# EAGLE design PCB-AC4 (EAGLE 7.7.0)

## Sheet 1 of 2
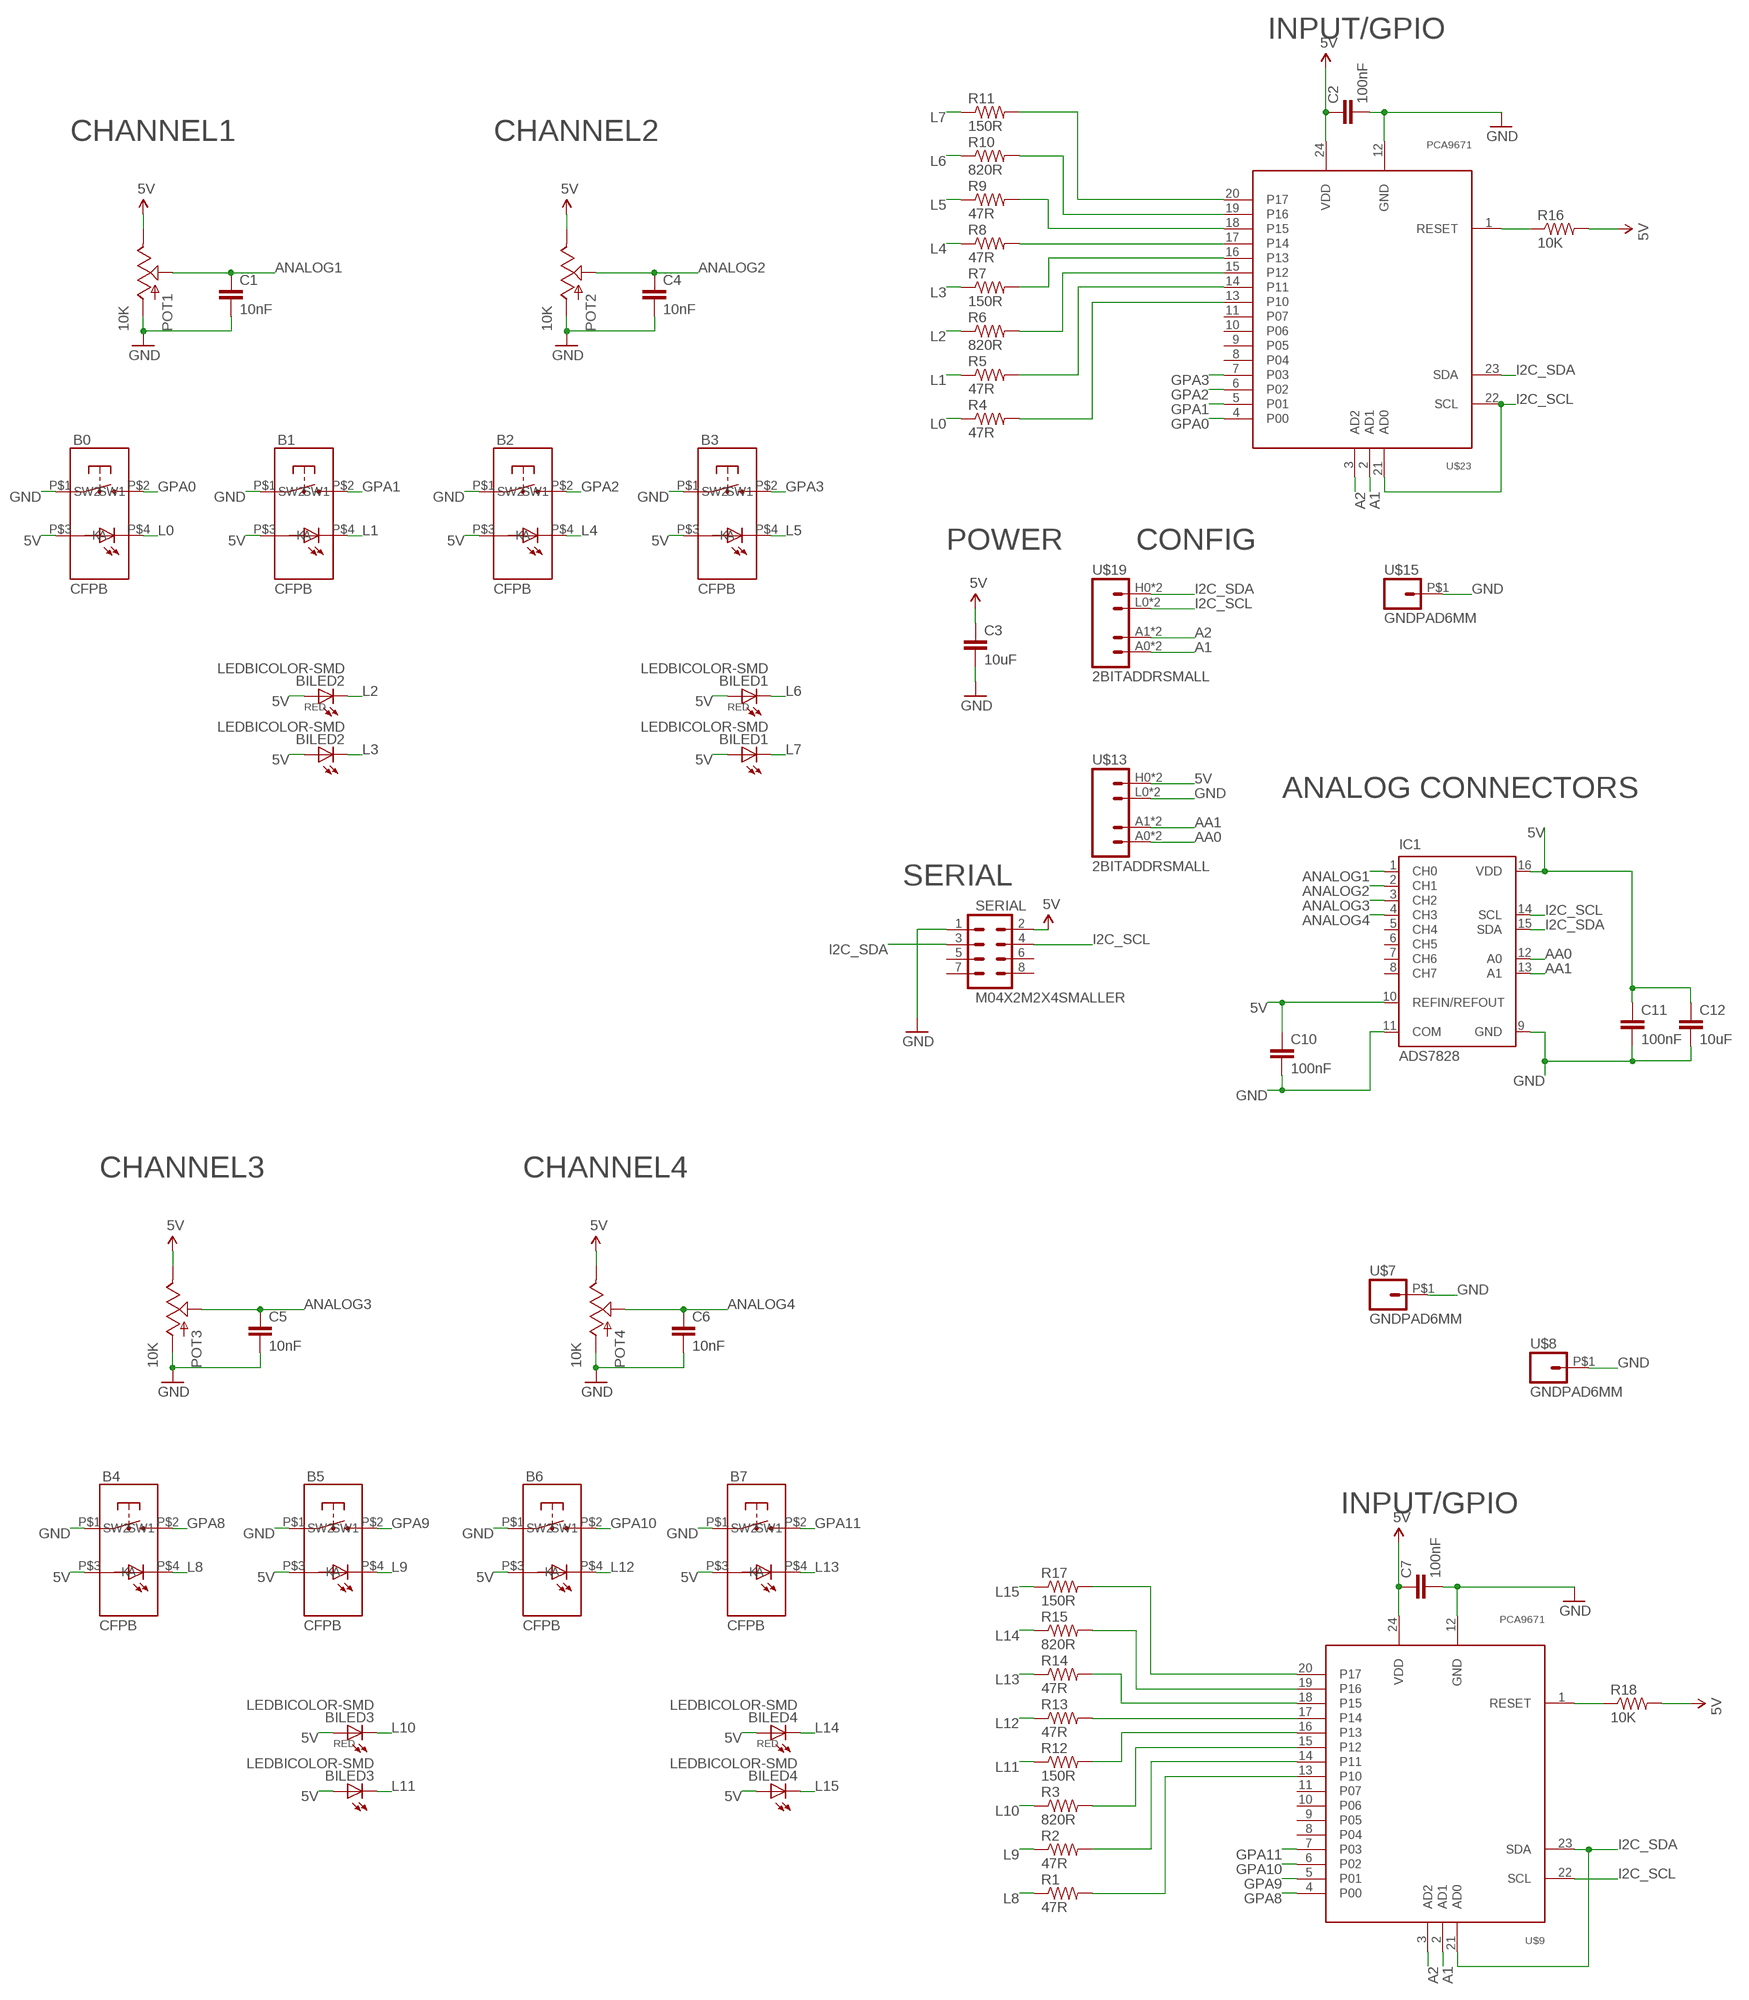
[diagram p0: schematic, sheet 1]

### Parts
B0  CFPB  [CFPB-6/9MM]
B1  CFPB  [CFPB-6/9MM]
B2  CFPB  [CFPB-6/9MM]
B3  CFPB  [CFPB-6/9MM]
B4  CFPB  [CFPB-6/9MM]
B5  CFPB  [CFPB-6/9MM]
B6  CFPB  [CFPB-6/9MM]
B7  CFPB  [CFPB-6/9MM]
BILED1  LEDBICOLOR-SMD  [LEDBICOLOR-SMD]
BILED2  LEDBICOLOR-SMD  [LEDBICOLOR-SMD]
BILED3  LEDBICOLOR-SMD  [LEDBICOLOR-SMD]
BILED4  LEDBICOLOR-SMD  [LEDBICOLOR-SMD]
C1  10nF  CAP0603-CAP  [0603-CAP]
C2  100nF  CAP0603-CAP  [0603-CAP]
C3  10uF  CAP0805  [0805]
C4  10nF  CAP0603-CAP  [0603-CAP]
C5  10nF  CAP0603-CAP  [0603-CAP]
C6  10nF  CAP0603-CAP  [0603-CAP]
C7  100nF  CAP0603-CAP  [0603-CAP]
C10  100nF  CAP0603-CAP  [0603-CAP]
C11  100nF  CAP0603-CAP  [0603-CAP]
C12  10uF  CAP0805  [0805]
IC1  ADS7828  [TSSOP16-PW]
POT1  10K  POT  [ALPS_POT]
POT2  10K  POT  [ALPS_POT]
POT3  10K  POT  [ALPS_POT]
POT4  10K  POT  [ALPS_POT]
R1  47R  RESISTOR0603-RES  [0603-RES]
R2  47R  RESISTOR0603-RES  [0603-RES]
R3  820R  RESISTOR0603-RES  [0603-RES]
R4  47R  RESISTOR0603-RES  [0603-RES]
R5  47R  RESISTOR0603-RES  [0603-RES]
R6  820R  RESISTOR0603-RES  [0603-RES]
R7  150R  RESISTOR0603-RES  [0603-RES]
R8  47R  RESISTOR0603-RES  [0603-RES]
R9  47R  RESISTOR0603-RES  [0603-RES]
R10  820R  RESISTOR0603-RES  [0603-RES]
R11  150R  RESISTOR0603-RES  [0603-RES]
R12  150R  RESISTOR0603-RES  [0603-RES]
R13  47R  RESISTOR0603-RES  [0603-RES]
R14  47R  RESISTOR0603-RES  [0603-RES]
R15  820R  RESISTOR0603-RES  [0603-RES]
R16  10K  RESISTOR0603-RES  [0603-RES]
R17  150R  RESISTOR0603-RES  [0603-RES]
R18  10K  RESISTOR0603-RES  [0603-RES]
SERIAL  M04X2M2X4SMALLER  [M2X4SMALLER]
U$7  GNDPAD6MM  [3.2MMPAD6MM]
U$8  GNDPAD6MM  [3.2MMPAD6MM]
U$9  PCA9671  [TSSOP24]
U$13  2BITADDRSMALL  [2BITADDR_SMALL]
U$15  GNDPAD6MM  [3.2MMPAD6MM]
U$19  2BITADDRSMALL  [2BITADDR_SMALL]
U$23  PCA9671  [TSSOP24]

### Nets
5V [Power]: B0.P$3(A) B1.P$3(A) B2.P$3(A) B3.P$3(A) B4.P$3(A) B5.P$3(A) B6.P$3(A) B7.P$3(A) BILED1.P$1(A) BILED1.P$3(A1) BILED2.P$1(A) BILED2.P$3(A1) BILED3.P$1(A) BILED3.P$3(A1) BILED4.P$1(A) BILED4.P$3(A1) C2.1 C3.1 C7.1 C10.1 C11.1 C12.1 IC1.10(REFIN/REFOUT) IC1.16(VDD) POT1.P$1(E) POT2.P$1(E) POT3.P$1(E) POT4.P$1(E) R16.2 R18.2 SERIAL.2 U$9.24(VDD) U$13.H0(VCC) U$13.H1(VCC) U$23.24(VDD)
A1: U$9.2(AD1) U$19.A0(A1) U$19.AS0(A1) U$23.2(AD1)
A2: U$9.3(AD2) U$19.A1(A2) U$19.AS1(A2) U$23.3(AD2)
AA0: IC1.12(A0) U$13.A0(A1) U$13.AS0(A1)
AA1: IC1.13(A1) U$13.A1(A2) U$13.AS1(A2)
ANALOG1: C1.1 IC1.1(CH0) POT1.P$2(S)
ANALOG2: C4.1 IC1.2(CH1) POT2.P$2(S)
ANALOG3: C5.1 IC1.3(CH2) POT3.P$2(S)
ANALOG4: C6.1 IC1.4(CH3) POT4.P$2(S)
GND [Power]: B0.P$1(SW1) B1.P$1(SW1) B2.P$1(SW1) B3.P$1(SW1) B4.P$1(SW1) B5.P$1(SW1) B6.P$1(SW1) B7.P$1(SW1) C1.2 C2.2 C3.2 C4.2 C5.2 C6.2 C7.2 C10.2 C11.2 C12.2 IC1.9(GND) IC1.11(COM) POT1.P$3(A) POT2.P$3(A) POT3.P$3(A) POT4.P$3(A) SERIAL.1 U$7.P$1 U$8.P$1 U$9.12(GND) U$13.L0(GND) U$13.L1(GND) U$15.P$1 U$23.12(GND)
GPA0: B0.P$2(SW2) U$23.4(P00)
GPA1: B1.P$2(SW2) U$23.5(P01)
GPA2: B2.P$2(SW2) U$23.6(P02)
GPA3: B3.P$2(SW2) U$23.7(P03)
GPA8: B4.P$2(SW2) U$9.4(P00)
GPA9: B5.P$2(SW2) U$9.5(P01)
GPA10: B6.P$2(SW2) U$9.6(P02)
GPA11: B7.P$2(SW2) U$9.7(P03)
I2C_SCL: IC1.14(SCL) SERIAL.4 U$9.22(SCL) U$19.L0(GND) U$19.L1(GND) U$23.21(AD0) U$23.22(SCL)
I2C_SDA: IC1.15(SDA) SERIAL.3 U$9.21(AD0) U$9.23(SDA) U$19.H0(VCC) U$19.H1(VCC) U$23.23(SDA)
L0: B0.P$4(K) R4.1
L1: B1.P$4(K) R5.1
L2: BILED2.P$2(C) R6.1
L3: BILED2.P$4(C1) R7.1
L4: B2.P$4(K) R8.1
L5: B3.P$4(K) R9.1
L6: BILED1.P$2(C) R10.1
L7: BILED1.P$4(C1) R11.1
L8: B4.P$4(K) R1.1
L9: B5.P$4(K) R2.1
L10: BILED3.P$2(C) R3.1
L11: BILED3.P$4(C1) R12.1
L12: B6.P$4(K) R13.1
L13: B7.P$4(K) R14.1
L14: BILED4.P$2(C) R15.1
L15: BILED4.P$4(C1) R17.1
N$1: R12.2 U$9.16(P13)
N$2: R7.2 U$23.16(P13)
N$3: R8.2 U$23.17(P14)
N$4: R9.2 U$23.18(P15)
N$5: R10.2 U$23.19(P16)
N$6: R11.2 U$23.20(P17)
N$7: R6.2 U$23.15(P12)
N$8: R5.2 U$23.14(P11)
N$9: R4.2 U$23.13(P10)
N$10: R13.2 U$9.17(P14)
N$11: R14.2 U$9.18(P15)
N$12: R15.2 U$9.19(P16)
N$13: R17.2 U$9.20(P17)
N$14: R3.2 U$9.15(P12)
N$15: R2.2 U$9.14(P11)
N$16: R1.2 U$9.13(P10)
N$17: R18.1 U$9.1(RESET)
N$22: R16.1 U$23.1(RESET)
Unconnected: IC1.5(CH4) IC1.6(CH5) IC1.7(CH6) IC1.8(CH7) SERIAL.5 SERIAL.6 SERIAL.7 SERIAL.8 U$9.8(P04) U$9.9(P05) U$9.10(P06) U$9.11(P07) U$23.8(P04) U$23.9(P05) U$23.10(P06) U$23.11(P07)

### Notes on the sheet
- INPUT/GPIO
- CHANNEL1 | CHANNEL2
- POWER | CONFIG
- ANALOG CONNECTORS
- SERIAL
- CHANNEL3 | CHANNEL4
- INPUT/GPIO

## Sheet 2 of 2

## Library data of the parts
B0 B1-B7 = SKAARHOJ:CFPB
BILED1-BILED4 = SKAARHOJ:LEDBICOLOR-SMD
C1-C7 C10-C12 = SparkFun:CAP: Capacitor Standard 0603 ceramic capacitor, and 0.1" leaded capacitor.
IC1 = burr-brown:ADS7828: 12-Bit, 8-Channel Sampling ANALOG-TO-DIGITAL CONVERTER with I2C? Interface Source: www.ti.com .. ADS7828.pdf; MF: TEXAS INSTRUMENTS; MPN: ADS7828E/250; OC_FARNELL: 1470338; OC_NEWARK: 74C7158
POT1-POT4 = SparkFun:POT
R1-R18 = SparkFun:RESISTOR: Resistor Basic schematic elements and footprints for 0603, 1206, and PTH resistors.
SERIAL = SKAARHOJ:M04X2
U$7 U$8 U$15 = SKAARHOJ:GNDPAD
U$9 U$23 = SKAARHOJ:PCA9671
U$13 U$19 = SKAARHOJ:2BITADDR

## Net classes
0 default: width 0.203 mm, drill 0.406 mm, clearance 0.203 mm
1 Power: width 0.406 mm, drill 0.61 mm, clearance 0.203 mm
2 Signal: width 0.152 mm, clearance 0.152 mm

## Board
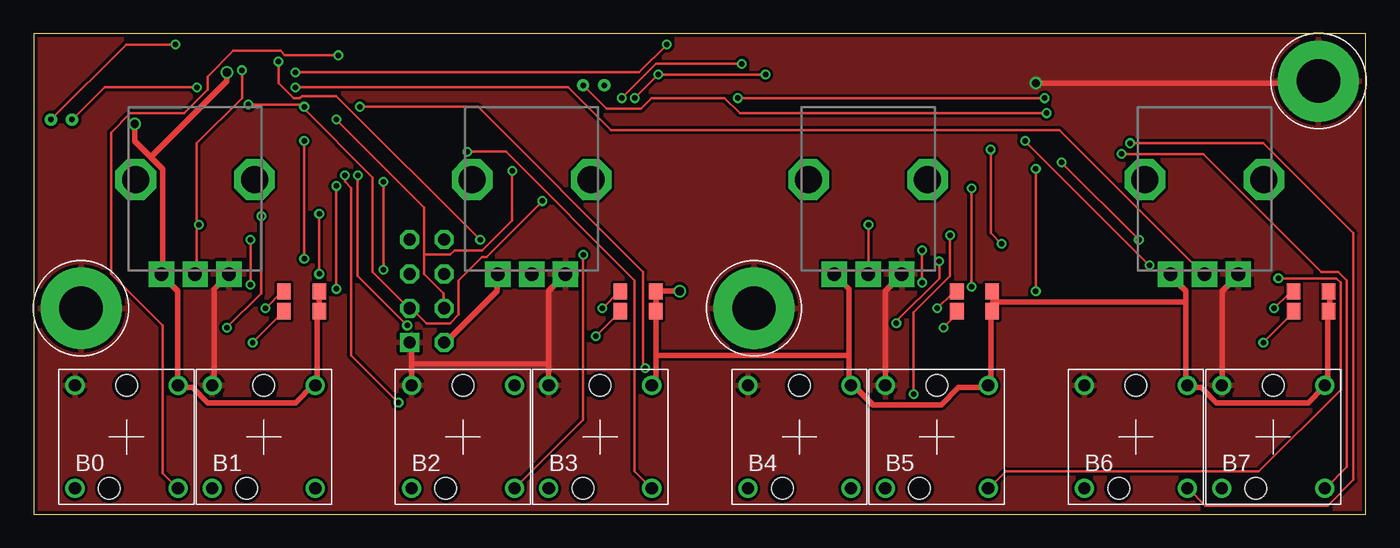
[diagram p1: board, top side]
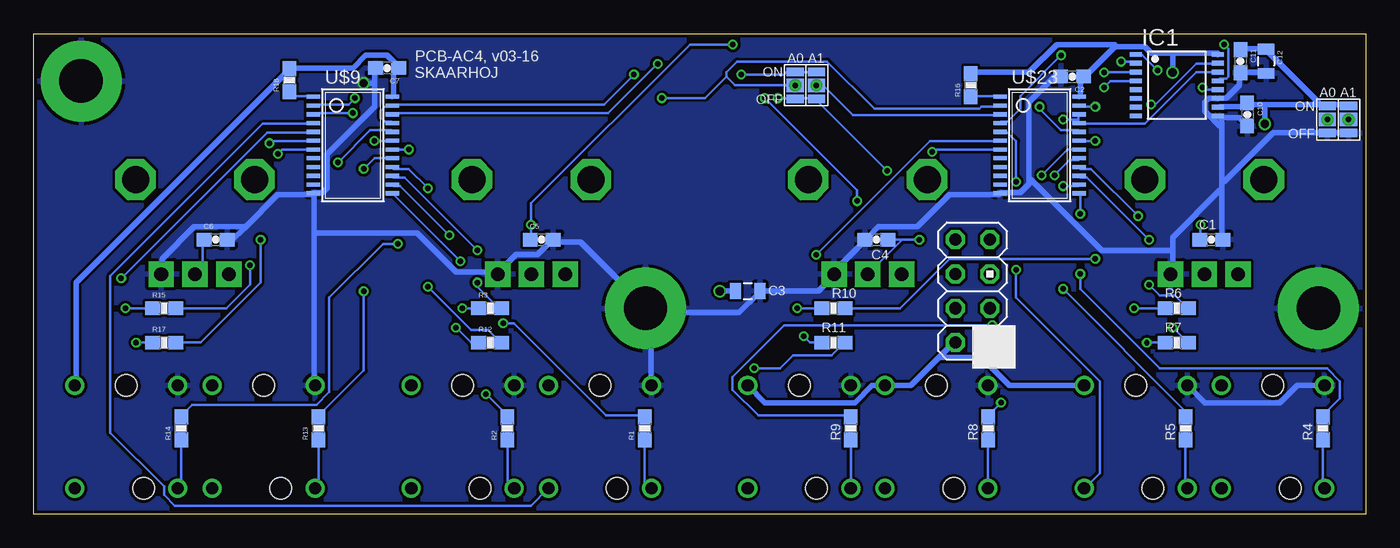
[diagram p2: board, bottom side, seen from below]

Size 98.54 x 35.56 mm. Coordinates in mm from the lower left corner, seen from the top.
Outline: 0,0 98.54,0 98.54,35.56 0,35.56 0,0
Copper layers (1*16): Top 0.035mm / dielectric 1.5mm / Bottom 0.035mm
Design rules "Fusion_eagle_rule_v1.1": minimum track width 6mil, minimum drill 12mil, track to track 6mil, track to pad 6mil, pad to pad 6mil, via to via 6mil, smd to smd 0mil, copper to edge 10mil, drill to drill 10mil, minimum pad ring 10mil, minimum via ring 6mil, stop-mask expansion 2mil, vias tented up to drill 100mil, thermal gap 10mil

### Footprints (pad centres in the part's own frame; a part is rotated, then mirrored left to right if it is on the bottom)
CFPB-6/9MM = drill 0.9: P$1 -3.81,3.81; P$2 3.81,-3.81; P$3 3.81,3.81; P$4 -3.81,-3.81 | hole 1.6: 0,3.81; -1.27,-3.81
LEDBICOLOR-SMD = smd 1 x 1.2: P$1 1.3,0.725; P$2 -1.3,0.725; P$3 1.3,-0.725; P$4 -1.3,-0.725
0603-CAP = smd 1.1 x 1: 1 -0.85,0; 2 0.85,0
0805 = smd 0.8 x 1.2: 1 -0.9,0; 2 0.9,0
TSSOP16-PW = smd 0.35 x 0.9: 1 -2.275,-3.025; 2 -1.625,-3.025; 3 -0.975,-3.025; 4 -0.325,-3.025; 5 0.325,-3.025; 6 0.975,-3.025; 7 1.625,-3.025; 8 2.275,-3.025; 9 2.275,3.025; 10 1.625,3.025; 11 0.975,3.025; 12 0.325,3.025; 13 -0.325,3.025; 14 -0.975,3.025; 15 -1.625,3.025; 16 -2.275,3.025
ALPS_POT = drill 1 pad 1.88 square: P$1 7,-2.5; P$2 7,0; P$3 7,2.5 | drill 2 octagon: P$4 0,-4.4; P$5 0,4.4
0603-RES = smd 1.1 x 1: 1 -0.85,0; 2 0.85,0
M2X4SMALLER = drill 0.9 square: 1 -1.27,3.81 | drill 0.9 octagon: 2 1.27,3.81; 3 -1.27,1.27; 4 1.27,1.27; 5 -1.27,-1.27; 6 1.27,-1.27; 7 -1.27,-3.81; 8 1.27,-3.81
3.2MMPAD6MM = drill 3.2 pad 6: P$1 0,0
TSSOP24 = smd 0.305 x 0.991: 1 -4.225,-2.918; 2 -3.575,-2.918; 3 -2.925,-2.918; 4 -2.275,-2.918; 5 -1.625,-2.918; 6 -0.975,-2.918; 7 -0.325,-2.918; 8 0.325,-2.918; 9 0.975,-2.918; 10 1.625,-2.918; 11 2.275,-2.918; 12 2.925,-2.918; 13 2.925,2.918; 14 2.275,2.918; 15 1.625,2.918; 16 0.975,2.918; 17 0.325,2.918; 18 -0.325,2.918; 19 -0.975,2.918; 20 -1.625,2.918; 21 -2.275,2.918; 22 -2.925,2.918; 23 -3.575,2.918; 24 -4.225,2.918
2BITADDR_SMALL = drill 0.4: A0 -1.565,0; A1 0,0 | smd 1.27 x 1: AS0 -1.565,0; AS1 0,0 | smd 1.27 x 0.635: H0 -1.565,1; H1 0,1; L0 -1.565,-1; L1 0,-1

### Placement (x,y rotation side)
B0  6.86,5.71 0 top
B1  17.02,5.71 0 top
B2  31.75,5.71 0 top
B3  41.91,5.71 0 top
B4  56.64,5.71 0 top
B5  66.8,5.71 0 top
B6  81.53,5.71 0 top
B7  91.69,5.71 0 top
BILED1  44.7,15.75 0 top
BILED2  19.81,15.75 0 top
BILED3  69.6,15.75 0 top
BILED4  94.49,15.75 0 top
C1  11.43,20.32 0 bottom
C2  21.72,32.38 180 bottom
C3  45.72,16.51 0 bottom
C4  36.2,20.32 180 bottom
C5  60.96,20.32 0 bottom
C6  85.09,20.32 0 bottom
C7  72.39,33.02 180 bottom
C10  8.76,29.59 270 bottom
C11  9.27,33.53 270 bottom
C12  7.37,33.53 270 bottom
IC1  13.97,31.75 270 bottom
POT1  11.94,24.77 270 top
POT2  36.83,24.77 270 top
POT3  61.72,24.77 270 top
POT4  86.61,24.77 270 top
R1  53.34,6.35 90 bottom
R2  63.5,6.35 90 bottom
R3  64.77,15.24 0 bottom
R4  3.17,6.35 90 bottom
R5  13.34,6.35 90 bottom
R6  13.97,15.24 0 bottom
R7  13.97,12.7 0 bottom
R8  27.94,6.35 90 bottom
R9  38.1,6.35 90 bottom
R10  39.37,15.24 0 bottom
R11  39.37,12.7 0 bottom
R12  64.77,12.7 0 bottom
R13  77.47,6.35 90 bottom
R14  87.63,6.35 90 bottom
R15  88.9,15.24 0 bottom
R16  29.21,31.75 90 bottom
R17  88.9,12.7 0 bottom
R18  79.63,32.13 90 bottom
SERIAL  29.08,16.51 180 bottom
U$7  95.04,32.06 0 top
U$8  53.28,15.24 0 top
U$9  74.93,26.67 270 bottom
U$13  1.27,29.21 0 bottom
U$15  3.5,15.24 0 top
U$19  40.64,31.75 0 bottom
U$23  24.13,26.67 270 bottom

### Tracks (layer width: path | path; a pad name or v marks a point on that pad's centre or on a via)
5V  (via drill 0.61)
  Top 0.406: v7.46,28.89 7.46,27.62 8.65,26.43 | 8.65,26.43 9.53,25.56 9.53,17.94 POT1.P$1 9.53,17.62 10.64,16.51 10.64,9.53 B0.P$3 10.79,9.37 11.75,9.37 12.86,8.26 19.37,8.26 20.64,9.53 B1.P$3 20.95,9.53 20.95,14.92 BILED2.P$3 21.11,15.08 21.11,16.35 BILED2.P$1 | v14.29,32.7 14.29,32.07 8.65,26.43 | 70.96,15.72 70.96,16.35 BILED3.P$1 | 70.96,15.72 70.96,15.08 BILED3.P$3 70.8,14.92 70.8,9.68 70.64,9.53 B5.P$3 70.48,9.37 68.42,9.37 67.15,8.1 62.07,8.1 60.64,9.53 B4.P$3 60.33,9.53 60.33,11.75 | 85.25,15.72 85.25,16.51 84.14,17.62 POT4.P$1 | 85.25,15.72 85.25,9.53 B6.P$3 85.41,9.37 86.36,9.37 87.47,8.26 94.3,8.26 95.41,9.37 B7.P$3 95.57,9.53 95.73,9.68 95.73,14.92 BILED4.P$3 95.89,15.08 95.89,16.35 BILED4.P$1 | 85.25,15.72 70.96,15.72 | POT2.P$1 34.29,17.62 34.29,16.51 30.48,12.7 SERIAL.2 | v47.78,16.51 46.2,16.51 BILED1.P$1 46.04,16.35 46.04,15.08 BILED1.P$3 46.04,14.92 46.04,11.75 | 46.04,11.75 46.04,9.84 B3.P$3 | 60.33,11.75 60.33,16.67 59.37,17.62 POT3.P$1 | 60.33,11.75 46.04,11.75
  Bottom 0.406: 14.29,34.13 15.88,34.13 16.35,34.61 18.57,34.61 | 14.29,34.13 10.95,34.13 IC1.16 | 18.57,34.61 20.8,32.38 C2.1 20.95,32.23 21.11,32.07 21.11,30.96 U$23.24 | R16.2 29.21,32.7 24.92,32.7 22.86,34.77 18.57,34.77 18.57,34.61 | C11.1 9.21,34.45 7.46,34.45 C12.1 7.3,34.29 3.49,30.48 3.49,30.32 | U$13.H1 1.27,30.32 2.7,30.32 U$13.H0 3.02,30.32 3.49,30.32 | IC1.10 10.79,30.16 9.05,30.16 8.89,30.32 C10.1 8.73,30.32 7.46,30.32 | 7.46,30.32 3.49,30.32 | v7.46,28.89 7.46,30.32 | v14.29,32.7 14.29,34.13 | U$9.24 71.91,30.96 71.91,32.7 71.6,33.02 C7.1 71.6,33.18 72.39,33.97 73.98,33.97 74.93,33.02 79.53,33.02 R18.2 79.69,32.86 95.41,17.14 95.41,9.53 B7.P$3 | 31.51,11.67 30.48,12.7 SERIAL.2 | 31.51,11.67 33.66,9.53 B2.P$3 36.51,9.53 37.78,8.26 44.45,8.26 B3.P$3 | B1.P$3 26.35,9.53 28.42,11.59 31.43,11.59 31.51,11.67 | v47.78,16.51 C3.1
A1  (via drill 0.41)
  Top 0.203: v52.07,30.8 v74.77,30.8
  Bottom 0.203: 47.31,32.38 47.31,32.7 46.51,33.5 39.85,33.5 36.35,30 28.57,30 28.42,30.16 27.15,30.16 U$23.2 | 47.31,32.38 46.67,31.75 42.23,31.75 U$19.A0 | v74.77,30.8 75.25,30.32 77.79,30.32 U$9.2 | v52.07,30.8 48.9,30.8 47.31,32.38
A2  (via drill 0.41)
  Top 0.203: v74.93,29.69 52.23,29.69 51.12,30.8 45.72,30.8 44.93,30 42.39,30 U$19.A1
  Bottom 0.203: U$19.A1 40.16,31.75 37.94,29.53 27.15,29.53 U$23.3 | v74.93,29.69 77.79,29.69 U$9.3
AA0  (via drill 0.41)
  Top 0.203: v12.06,31.59 5.24,31.59 2.86,29.21 U$13.A0
  Bottom 0.203: v12.06,31.59 11.91,31.43 IC1.12 | 2.86,29.21 U$13.A0
AA1  (via drill 0.41)
  Top 0.203: v10.48,34.77 6.83,34.77 U$13.AS1
  Bottom 0.203: v10.48,34.77 10.16,34.45 10.16,32.38 10.32,32.23 10.79,32.23 IC1.13
ANALOG1  (via drill 0.41)
  Top 0.203: v15.4,32.86 15.4,30.8 12.06,27.46 12.06,21.43 | 12.06,21.43 12.06,17.78 POT1.P$2 | 12.06,21.43 v12.22,21.43
  Bottom 0.203: v15.4,32.86 16.51,33.97 16.99,33.97 IC1.1 | v12.22,21.43 12.22,20.32 C1.1
ANALOG2  (via drill 0.41)
  Top 0.203: v18.1,33.5 18.1,31.91 19.21,30.8 19.68,30.8 19.84,30.96 22.38,30.96 v33.02,20.32
  Bottom 0.203: v18.1,33.5 17.14,33.5 IC1.2 | C4.1 34.29,20.32 | 34.29,20.32 v33.02,20.32 | 34.29,20.32 POT2.P$2
ANALOG3  (via drill 0.41)
  Top 0.203: v19.37,32.7 44.77,32.7 v46.83,34.77 | v61.75,21.43 61.75,17.78 POT3.P$2
  Bottom 0.203: v19.37,32.7 17.14,32.7 IC1.3 | v46.83,34.77 50.01,34.77 61.75,23.02 v61.75,21.43 61.75,20.32 C5.1
ANALOG4  (via drill 0.41)
  Top 0.203: v19.37,31.59 39.53,31.59 42.7,28.42 75.88,28.42 86.52,17.78 POT4.P$2
  Bottom 0.203: v19.37,31.59 18.89,32.07 17.14,32.07 IC1.4 | C6.1 86.04,20.32 86.04,18.26 86.52,17.78 POT4.P$2
GND  (via drill 0.61)
  Top 0.406: B7.P$1 87.95,9.53 87.95,16.51 89.06,17.62 POT4.P$3 | v74.14,31.91 94.93,31.91 U$7.P$1 | B1.P$1 13.34,9.53 13.34,16.67 14.29,17.62 POT1.P$3 | B5.P$1 63.02,9.53 63.02,16.51 64.14,17.62 POT3.P$3 | 27.94,11.11 27.94,12.7 SERIAL.1 | 27.94,11.11 B2.P$1 | 38.1,11.11 38.1,16.51 39.21,17.62 POT2.P$3 | 38.1,11.11 B3.P$1 | 38.1,11.11 27.94,11.11
  Bottom 0.406: 82.95,21.19 83.82,20.32 C6.2 | 82.95,21.19 80.49,23.65 77.95,23.65 U$9.12 | 73.34,31.91 73.34,30.16 76.83,26.67 76.83,24.13 77.15,23.81 77.79,23.81 U$9.12 | 73.34,31.91 73.34,33.02 C7.2 | 77.79,20.8 77.79,23.65 U$9.12 | 77.79,20.8 77.79,9.53 B6.P$1 | POT4.P$3 89.06,17.78 89.06,18.89 86.68,21.27 83.03,21.27 82.95,21.19 | 73.34,31.91 v74.14,31.91 | B0.P$1 5.08,9.53 6.35,8.26 11.91,8.26 13.18,9.53 B1.P$1 | C12.2 7.46,32.7 9.21,32.7 C11.2 9.37,32.54 9.37,31.75 10.32,30.8 10.79,30.8 IC1.11 11.11,30.8 11.59,30.8 11.91,30.48 11.91,29.84 10.79,28.73 10.64,28.73 | U$13.L1 1.27,28.26 2.7,28.26 U$13.L0 3.02,28.26 6.83,28.26 10.48,24.61 10.64,24.61 | 10.64,29.37 9.37,29.37 8.89,28.89 C10.2 | 10.64,29.37 10.79,29.37 IC1.9 | 10.64,29.37 10.64,28.73 | 10.64,28.73 10.64,24.61 | 10.64,24.61 10.64,23.97 | 10.64,23.97 10.64,20.32 C1.2 | 14.29,19.53 14.29,20.48 10.79,23.97 10.64,23.97 | 14.29,19.53 14.29,17.78 POT1.P$3 | B4.P$1 52.86,9.53 52.86,14.92 53.18,15.24 U$8.P$1 | U$8.P$1 53.34,15.4 58.1,20.16 60.01,20.16 C5.2 60.17,20.32 61.28,19.21 62.87,19.21 64.29,17.78 POT3.P$3 64.29,17.94 67.31,17.94 70.17,20.8 77.79,20.8 | C2.2 23.02,32.38 24.92,30.48 24.92,24.77 | 24.92,24.77 24.92,24.45 25.56,23.81 26.99,23.81 U$23.12 27.15,23.65 30.8,23.65 33.18,21.27 36.04,21.27 36.99,20.32 C4.2 37.15,20.16 39.37,17.94 POT2.P$3 39.37,17.62 40.48,16.51 C3.2 44.93,16.35 46.35,14.92 52.7,14.92 U$8.P$1 | 14.29,19.53 19.53,19.53 24.77,24.77 24.92,24.77
  pour Top: 0,0 99.06,0 99.06,35.56 0,35.56
  pour Bottom: 0,0 99.06,0 99.06,35.56 0,35.56
GPA0  (via drill 0.41)
  Top 0.203: v22.54,33.97 18.57,33.97 18.26,34.29 14.76,34.29 12.86,32.38 12.86,31.43 11.11,29.69 7.14,29.69 5.71,28.26 5.71,17.78 9.53,13.97 9.53,3.02 10.64,1.91 B0.P$2
  Bottom 0.203: v22.54,33.97 25.56,30.96 25.56,30 26.51,29.05 26.99,29.05 U$23.4
GPA1  (via drill 0.41)
  Top 0.203: v25.88,18.1 v25.88,24.61
  Bottom 0.203: v25.88,24.61 25.88,27.62 26.51,28.26 26.99,28.26 U$23.5 | v25.88,18.1 25.88,16.03 19.68,9.84 19.68,3.02 20.8,1.91 B1.P$2
GPA2  (via drill 0.41)
  Top 0.203: v40.64,19.21 40.64,6.99 B2.P$2
  Bottom 0.203: v40.64,19.21 32.23,27.62 27.15,27.62 U$23.6
GPA3  (via drill 0.41)
  Top 0.203: v32.07,26.83 34.92,26.83 44.45,17.3 44.45,3.17 B3.P$2
  Bottom 0.203: v32.07,26.83 31.91,26.99 27.15,26.99 U$23.7
GPA8
  Bottom 0.203: U$9.4 77.95,28.89 81.6,28.89 92.87,17.62 92.87,6.03 88.9,2.06 88.9,1.43 88.11,0.64 61.75,0.64 60.48,1.91 B4.P$2
GPA9  (via drill 0.41)
  Top 0.203: v92.08,17.46 96.36,17.46 96.68,17.14 96.68,9.21 90.65,3.17 71.91,3.17 70.64,1.91 B5.P$2
  Bottom 0.203: v92.08,17.46 81.28,28.26 77.95,28.26 U$9.5
GPA10  (via drill 0.41)
  Top 0.203: v81.12,27.46 90.96,27.46 97.63,20.8 97.63,2.54 95.73,0.64 86.68,0.64 85.41,1.91 B6.P$2
  Bottom 0.203: v81.12,27.46 80.96,27.62 77.95,27.62 U$9.6
GPA11  (via drill 0.41)
  Top 0.203: v80.49,26.67 86.52,26.67 95.25,17.94 96.52,17.94 97.16,17.3 97.16,3.49 95.57,1.91 B7.P$2
  Bottom 0.203: v80.49,26.67 80.17,26.99 77.95,26.99 U$9.7
I2C_SCL  (via drill 0.41)
  Top 0.203: v52.39,33.34 46.04,33.34 v43.5,30.8 | 28.89,19.21 28.89,22.7 v22.38,29.21 | 28.89,19.21 28.89,17.78 30.32,16.35 30.32,15.24 SERIAL.4 | v35.4,25.4 35.4,21.75 33.18,19.53 31.11,19.53 30.8,19.21 28.89,19.21
  Bottom 0.203: v52.39,33.34 56.04,29.69 71.91,29.69 U$9.22 | v43.5,30.8 42.23,30.8 U$19.L0 42.07,30.8 40.64,30.8 U$19.L1 40.64,30.64 v35.4,25.4 | IC1.14 10.95,32.7 12.54,32.7 16.35,28.89 21.11,28.89 U$23.21 21.27,29.05 21.27,29.21 | 21.27,29.21 21.27,29.53 U$23.22 | 21.27,29.21 v22.38,29.21
I2C_SDA  (via drill 0.41)
  Top 0.203: v54.13,32.54 v46.2,32.54 v44.45,30.8 | v15.88,30.32 19.68,30.32 19.84,30.16 | 19.84,30.16 25.08,24.92 25.08,17.94 27.78,15.24 SERIAL.3 27.94,15.24 29.05,14.13 30.8,14.13 31.43,14.76 31.43,17.3 33.18,19.05 33.5,19.05 v37.62,23.18 | 19.84,30.16 v20,30.16
  Bottom 0.203: U$9.21 72.07,29.05 72.55,29.05 72.87,29.37 72.87,29.84 72.55,30.16 72.07,30.16 U$9.23 71.91,30.32 56.36,30.32 v54.13,32.54 | U$19.H1 40.64,32.7 42.07,32.7 U$19.H0 42.23,32.7 42.86,32.7 43.02,32.54 v46.2,32.54 | v15.88,30.32 15.56,30.32 12.54,33.34 10.95,33.34 IC1.15 | v20,30.16 21.11,30.16 U$23.23 | v44.45,30.8 37.62,23.97 v37.62,23.18
L0
  Bottom 0.203: R4.1 3.17,1.91 B0.P$4
L1
  Bottom 0.203: R5.1 13.34,1.91 B1.P$4
L2  (via drill 0.41)
  Top 0.203: v17.14,15.24 18.41,16.51 BILED2.P$2
  Bottom 0.203: v17.14,15.24 R6.1
L3  (via drill 0.41)
  Top 0.203: v16.19,12.7 18.41,14.92 BILED2.P$4
  Bottom 0.203: v16.19,12.7 R7.1
L4
  Bottom 0.203: B2.P$4 R8.1
L5
  Bottom 0.203: B3.P$4 R9.1
L6  (via drill 0.41)
  Top 0.203: v42.07,15.24 43.34,16.51 BILED1.P$2
  Bottom 0.203: v42.07,15.24 R10.1
L7  (via drill 0.41)
  Top 0.203: v41.59,13.18 43.34,14.92 BILED1.P$4
  Bottom 0.203: R11.1 41.12,12.7 v41.59,13.18
L8
  Bottom 0.203: R1.1 53.34,2.38 52.86,1.91 B4.P$4
L9
  Bottom 0.203: R2.1 63.5,2.38 63.02,1.91 B5.P$4
L10  (via drill 0.41)
  Top 0.203: v66.83,15.24 67.94,16.35 68.26,16.35 BILED3.P$2
  Bottom 0.203: v66.83,15.24 R3.1
L11  (via drill 0.41)
  Top 0.203: v67.31,13.81 68.42,14.92 BILED3.P$4
  Bottom 0.203: R12.1 66.2,12.7 v67.31,13.81
L12
  Bottom 0.203: R13.1 77.47,2.06 77.63,1.91 B6.P$4
L13
  Bottom 0.203: R14.1 87.63,2.06 87.79,1.91 B7.P$4
L14  (via drill 0.41)
  Top 0.203: v91.76,15.24 92.87,16.35 93.19,16.35 BILED4.P$2
  Bottom 0.203: v91.76,15.24 R15.1
L15  (via drill 0.41)
  Top 0.203: v90.96,12.7 93.19,14.92 BILED4.P$4
  Bottom 0.203: v90.96,12.7 R17.1
N$1  (via drill 0.41)
  Top 0.203: v69.37,16.83 v69.37,24.13
  Bottom 0.203: v69.37,24.13 70.8,25.56 71.91,25.56 U$9.16 | v69.37,16.83 66.2,13.65 64.93,13.65 63.98,12.7 R12.2
N$2  (via drill 0.41)
  Top 0.203: v16.83,22.07 16.83,16.35 v14.29,13.81
  Bottom 0.203: v16.83,22.07 20.32,25.56 21.11,25.56 U$23.16 | v14.29,13.81 13.18,12.7 R7.2
N$3  (via drill 0.41)
  Top 0.203: v23.02,25.08 23.02,24.61 23.5,24.13 23.5,11.75 v26.99,8.26
  Bottom 0.203: v23.02,25.08 21.91,26.19 21.27,26.19 U$23.17 | v26.99,8.26 27.94,7.3 R8.2
N$4  (via drill 0.41)
  Top 0.203: v23.97,25.08 23.97,17.62 v27.62,13.97
  Bottom 0.203: v23.97,25.08 22.07,26.99 21.27,26.99 U$23.18 | v27.62,13.97 43.02,13.97 46.83,10.16 46.83,9.21 44.93,7.3 38.1,7.3 R9.2
N$5  (via drill 0.41)
  Top 0.203: v20,18.89 v20,27.62
  Bottom 0.203: v20,27.62 21.11,27.62 U$23.19 | v20,18.89 30.8,18.89 34.45,15.24 R10.2
N$6  (via drill 0.41)
  Top 0.203: v24.13,30.16 32.86,30.16 45.09,17.94 45.09,10.95 v45.24,10.79
  Bottom 0.203: v24.13,30.16 24.13,30 22.54,28.42 21.27,28.42 U$23.20 | v45.24,10.79 43.34,10.79 42.39,11.75 39.53,11.75 38.58,12.7 R11.2
N$7  (via drill 0.41)
  Top 0.203: v16.03,16.99 v16.03,20.32
  Bottom 0.203: v16.03,20.32 20.64,24.92 21.11,24.92 U$23.15 | v16.03,16.99 15.24,16.19 14.13,16.19 13.18,15.24 R6.2
N$8  (via drill 0.41)
  Top 0.203: v22.38,16.67 v22.38,24.29
  Bottom 0.203: v22.38,24.29 21.27,24.29 U$23.14 | v22.38,16.67 13.34,7.62 R5.2
N$9  (via drill 0.41)
  Top 0.203: v21.11,17.78 v21.11,22.23
  Bottom 0.203: v21.11,22.23 21.11,23.65 U$23.13 | v21.11,17.78 21.11,16.67 15.24,10.79 2.86,10.79 1.91,9.84 1.91,8.57 3.17,7.3 R4.2
N$10  (via drill 0.41)
  Top 0.203: v74.14,16.51 v74.14,25.56
  Bottom 0.203: v74.14,25.56 73.34,26.35 72.07,26.35 U$9.17 | v74.14,16.51 74.14,10.64 77.47,7.3 R13.2
N$11  (via drill 0.41)
  Top 0.203: v70.8,26.99 70.8,20.8 v71.6,20
  Bottom 0.203: v70.8,26.99 71.91,26.99 U$9.18 | v71.6,20 72.71,20 76.68,16.03 76.68,9.05 77.63,8.1 86.84,8.1 87.63,7.3 R14.2
N$12  (via drill 0.41)
  Top 0.203: v82.55,18.41 v73.34,27.62
  Bottom 0.203: v73.34,27.62 72.07,27.62 U$9.19 | v82.55,18.41 82.55,16.99 84.3,15.24 R15.2
N$13  (via drill 0.41)
  Top 0.203: v81.76,20.32 v76.04,26.04
  Bottom 0.203: v76.04,26.04 73.66,28.42 72.07,28.42 U$9.20 | v81.76,20.32 81.76,17.14 86.2,12.7 R17.2
N$14  (via drill 0.41)
  Top 0.203: v65.72,17.14 v65.72,19.53
  Bottom 0.203: v65.72,19.53 71.12,24.92 71.91,24.92 U$9.15 | v65.72,17.14 65.72,16.83 64.14,15.24 R3.2
N$15  (via drill 0.41)
  Top 0.203: v67.79,20.64 67.79,17.62 65.09,14.92 v65.09,8.89
  Bottom 0.203: v67.79,20.64 71.44,24.29 71.91,24.29 U$9.14 | v65.09,8.89 63.5,7.3 R2.2
N$16  (via drill 0.41)
  Top 0.203: v66.99,18.73 66.99,17.46 63.82,14.29 v63.82,14.13
  Bottom 0.203: v66.99,18.73 71.91,23.65 U$9.13 | v63.82,14.13 63.02,14.13 56.2,7.3 53.34,7.3 R1.2
N$17
  Bottom 0.203: U$9.1 77.95,30.96 79.22,30.96 79.53,31.27 R18.1
N$22
  Bottom 0.203: U$23.1 27.15,30.96 29.21,30.96 R16.1

### Text on the board
_bsilk: PCB-AC4, v03-16 / SKAARHOJ